# EAGLE design adp5350-breakout (EAGLE 9.6.2)
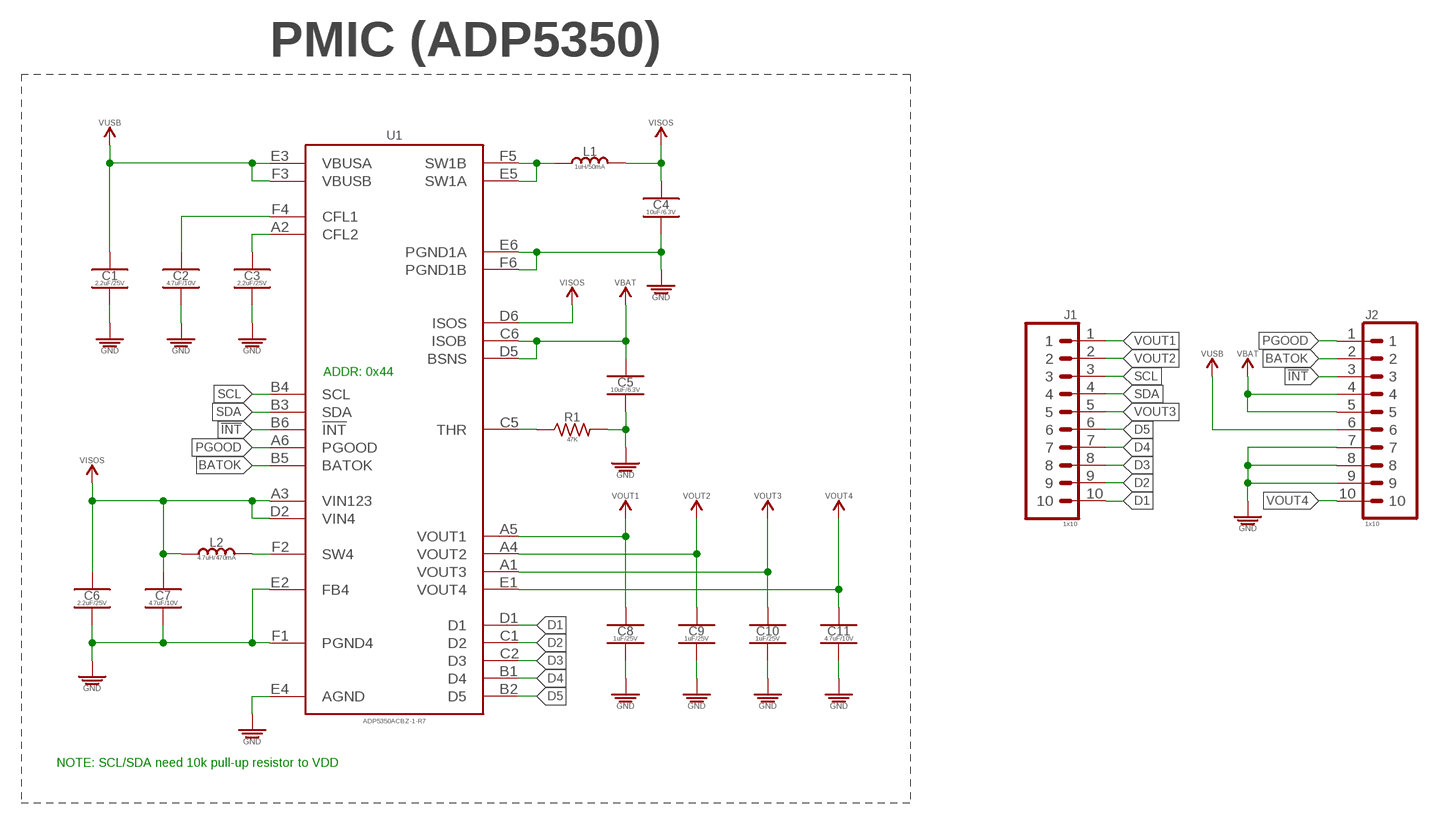
[diagram p0: schematic, sheet 1]

## Parts
C1  2.2uF/25V  2.2UF_CER_SMD-0402_25V-10%  [CAPC1005X55_SMD-0402]
C2  4.7uF/10V  4.7UF_CER_SMD-0402_10V-20%  [CAPC1005X55_SMD-0402]
C3  2.2uF/25V  2.2UF_CER_SMD-0402_25V-10%  [CAPC1005X55_SMD-0402]
C4  10uF/6.3V  10UF_CER_SMD-0402_6.3V-20%  [CAPC1005X55_SMD-0402]
C5  10uF/6.3V  10UF_CER_SMD-0402_6.3V-20%  [CAPC1005X55_SMD-0402]
C6  2.2uF/25V  2.2UF_CER_SMD-0402_25V-10%  [CAPC1005X55_SMD-0402]
C7  4.7uF/10V  4.7UF_CER_SMD-0402_10V-20%  [CAPC1005X55_SMD-0402]
C8  1uF/25V  1UF_CER_SMD-0402_25V-10%  [CAPC1005X55_SMD-0402]
C9  1uF/25V  1UF_CER_SMD-0402_25V-10%  [CAPC1005X55_SMD-0402]
C10  1uF/25V  1UF_CER_SMD-0402_25V-10%  [CAPC1005X55_SMD-0402]
C11  4.7uF/10V  4.7UF_CER_SMD-0402_10V-20%  [CAPC1005X55_SMD-0402]
J1  1x10  1X10_PTH_VERT-MALE_2.54MM  [HDRV10W64P254_1X10_2540X254X838B]
J2  1x10  1X10_PTH_VERT-MALE_2.54MM  [HDRV10W64P254_1X10_2540X254X838B]
L1  1uH/50mA  1UH_SMD-0603_0.50A-0.700OHM-10%  [INDC1608X60-0603]
L2  4.7uH/470mA  4.7UH_SMD-0603_470MA-0.312OHM-20%  [INDC1608X60-0603]
R1  47K  47KΩ_SMD-0402_1/16W-5%  [RESC1005X35_SMD-0402]
U1  ADP5350ACBZ-1-R7  [BGA36C50P6X6_331X336X66N]

## Nets
!INT!: J2.3 U1.B6(!INT!)
BATOK: J2.2 U1.B5(BATOK)
D1: J1.10 U1.D1
D2: J1.9 U1.C1(D2)
D3: J1.8 U1.C2(D3)
D4: J1.7 U1.B1(D4)
D5: J1.6 U1.B2(D5)
GND: C1.2 C2.2 C3.2 C4.2 C5.2 C6.2 C7.2 C8.2 C9.2 C10.2 C11.2 J2.7 J2.8 J2.9 R1.2 U1.E2(FB4) U1.E4(AGND) U1.E6(PGND1A) U1.F1(PGND4) U1.F6(PGND1B)
N$1: C3.1 U1.A2(CFL2)
N$2: C2.1 U1.F4(CFL1)
N$3: L2.2 U1.F2(SW4)
N$4: L1.1 U1.E5(SW1A) U1.F5(SW1B)
N$5: R1.1 U1.C5(THR)
PGOOD: J2.1 U1.A6(PGOOD)
SCL: J1.3 U1.B4(SCL)
SDA: J1.4 U1.B3(SDA)
VBAT: C5.1 J2.4 J2.5 U1.C6(ISOB) U1.D5(BSNS)
VISOS: C4.1 C6.1 C7.1 L1.2 L2.1 U1.A3(VIN123) U1.D2(VIN4) U1.D6(ISOS)
VOUT1: C8.1 J1.1 U1.A5(VOUT1)
VOUT2: C9.1 J1.2 U1.A4(VOUT2)
VOUT3: C10.1 J1.5 U1.A1(VOUT3)
VOUT4: C11.1 J2.10 U1.E1(VOUT4)
VUSB: C1.1 J2.6 U1.E3(VBUSA) U1.F3(VBUSB)

## Notes on the sheet
- PMIC (ADP5350)
- ADDR: 0x44
- NOTE: SCL/SDA need 10k pull-up resistor to VDD

## Library data of the parts
C1 C3 C6 = _capacitors:2.2UF; DATASHEET: https://product.tdk.com/info/en/catalog/datasheets/mlcc_commercial_general_en.pdf; DIST: Digikey; DISTLINK: https://www.digikey.com/products/en?keywords=445-9090-1-ND; DISTPN: 445-9090-1-ND; MFR: TDK Corporation; MPN: C1005X5R1E225K050BC
C2 C7 C11 = _capacitors:4.7UF; DATASHEET: http://www.samsungsem.com/kr/support/product-search/mlcc/CL05A475MP5NRNC.jsp; DIST: Digikey; DISTLINK: https://www.digikey.com/products/en?keywords=1276-1482-1-ND; DISTPN: 1276-1482-1-ND; MFR: Samsung Electro-Mechanics; MPN: CL05A475MP5NRNC
C4 C5 = _capacitors:10UF; DATASHEET: https://www.murata.com/~/media/webrenewal/support/library/catalog/products/capacitor/mlcc/c02e.ashx; DIST: Digikey; DISTLINK: https://www.digikey.com/products/en?keywords=490-13233-1-ND; DISTPN: 490-13233-1-ND; MFR: Murata Electronics North America; MPN: GRM155C80J106ME11D
C8-C10 = _capacitors:1UF; DATASHEET: https://product.tdk.com/info/en/catalog/datasheets/mlcc_commercial_lowprofile_en.pdf; DIST: Digikey; DISTLINK: https://www.digikey.com/products/en?keywords=445-13185-1-ND; DISTPN: 445-13185-1-ND; MFR: TDK Corporation; MPN: CGB2A1X5R1E105K033BC
J1 J2 = _connectors:1X10; DATASHEET: https://s3.amazonaws.com/catalogspreads-pdf/PAGE112-113%20.100%20MALE%20HDR.pdf; DIST: Digikey; DISTLINK: https://www.digikey.com/en/products/detail/sullins-connector-solutions/PEC10SAAN/859163?s=N4IgTCBcDaIMoEYAMCwFEC0yMDkAiIAugL5A; DISTPN: S1012E-10-ND; MFR: Sullins Connector Solutions; MPN: PEC10SAAN
L1 = _inductors:1UH; DATASHEET: https://product.tdk.com/info/en/catalog/datasheets/inductor_commercial_standard_mlf1608_en.pdf?ref_disty=digikey; DIST: Digikey; DISTLINK: https://www.digikey.com/en/products/detail/tdk-corporation/MLF1608A1R5KTA00/504184?s=N4IgTCBcDaICxwKwFoCMAGVLXIHIBEQBdAXyA; DISTPN: 445-1015-1-ND; MFR: TDK Corporation; MPN: MLF1608A1R5KTA00
L2 = _inductors:4.7UH; DATASHEET: http://ds.yuden.co.jp/TYCOMPAS/ut/detail.do?productNo=CBMF1608T4R7M&fileName=CBMF1608T4R7M_SS&mode=specSheetDownload; DIST: Digikey; DISTLINK: https://www.digikey.com/products/en?keywords=587-1719-1-ND; DISTPN: 587-1719-1-ND; MFR: Taiyo Yuden; MPN: CBMF1608T4R7M
R1 = _resistors:47KΩ; DATASHEET: http://www.yageo.com/NewPortal/yageodocoutput?fileName=/pdf/R-Chip/PYu-AC_51_RoHS_L_6.pdf; DIST: Digikey; DISTLINK: YAG3547CT-ND; DISTPN: YAG3547CT-ND; MFR: Yageo; MPN: AC0402JR-0747KL
U1 = _ic_power:ADP5350; DATASHEET: https://www.analog.com/media/en/technical-documentation/data-sheets/ADP5350.pdf; DIST: Digikey; DISTLINK: https://www.digikey.com/en/products/detail/analog-devices-inc/ADP5350ACBZ-1-R7/7932005?s=N4IgTCBcDaIIIBEAKBWAzCgDHAwgIQC0BaARiICUB2HAFSIDkEQBdAXyA; DISTPN: ADP5350ACBZ-1-R7CT-ND; MFR: Analog Devices Inc.; MPN: ADP5350ACBZ-1-R7

## Board
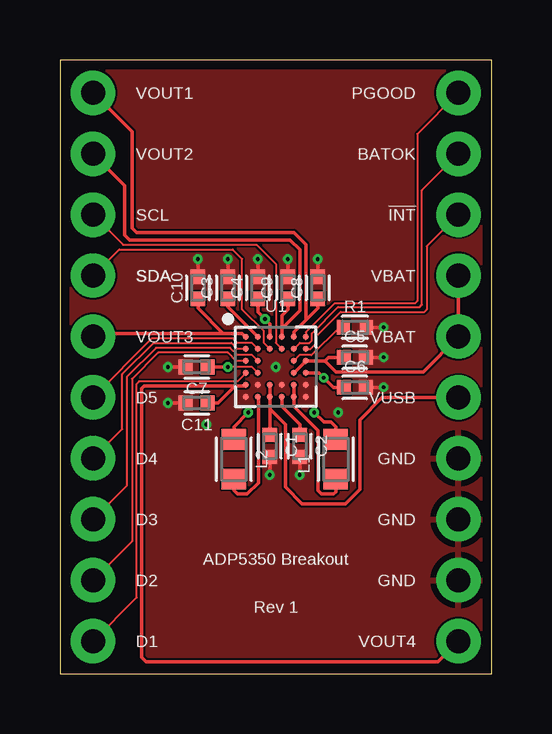
[diagram p1: board, top side]
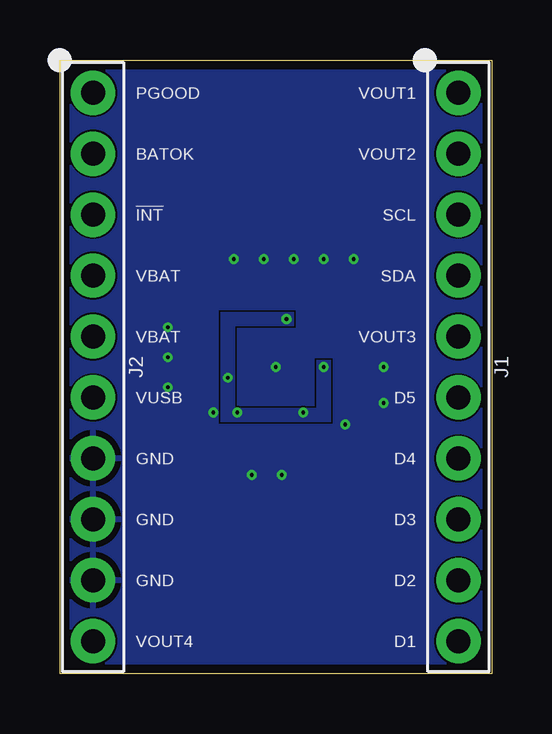
[diagram p2: board, bottom side, seen from below]

Size 18 x 25.6 mm. Coordinates in mm from the lower left corner, seen from the top.
Outline: 0,0 18,0 18,25.6 0,25.6 0,0
Copper layers (1*16): Top 0.035559375mm / dielectric 1.6mm / Bottom 0.035559375mm
Design rules "stella-wearables": minimum track width 3mil, minimum drill 6mil, track to track 3mil, track to pad 3mil, pad to pad 3mil, via to via 3mil, smd to smd 3mil, copper to edge 15mil, drill to drill 6mil, minimum pad ring 5mil, minimum via ring 5mil, stop-mask expansion 2.5mil, vias tented up to drill 0mil, thermal gap 10mil

### Footprints (pad centres in the part's own frame; a part is rotated, then mirrored left to right if it is on the bottom)
CAPC1005X55_SMD-0402 = smd 0.585 x 0.612: 1 -0.458,0; 2 0.458,0
HDRV10W64P254_1X10_2540X254X838B = drill 1 pad 1.85: 1 -11.43,0; 2 -8.89,0; 3 -6.35,0; 4 -3.81,0; 5 -1.27,0; 6 1.27,0; 7 3.81,0; 8 6.35,0; 9 8.89,0; 10 11.43,0
INDC1608X60-0603 = smd 0.859 x 1.015: 1 -0.828,0; 2 0.828,0
RESC1005X35_SMD-0402 = smd 0.535 x 0.6: 1 -0.482,0; 2 0.482,0
BGA36C50P6X6_331X336X66N = smd 0.25 x 0.25: A1 -1.25,1.25; A2 -0.75,1.25; A3 -0.25,1.25; A4 0.25,1.25; A5 0.75,1.25; A6 1.25,1.25; B1 -1.25,0.75; B2 -0.75,0.75; B3 -0.25,0.75; B4 0.25,0.75; B5 0.75,0.75; B6 1.25,0.75; C1 -1.25,0.25; C2 -0.75,0.25; C5 0.75,0.25; C6 1.25,0.25; D1 -1.25,-0.25; D2 -0.75,-0.25; D5 0.75,-0.25; D6 1.25,-0.25; E1 -1.25,-0.75; E2 -0.75,-0.75; E3 -0.25,-0.75; E4 0.25,-0.75; E5 0.75,-0.75; E6 1.25,-0.75; F1 -1.25,-1.25; F2 -0.75,-1.25; F3 -0.25,-1.25; F4 0.25,-1.25; F5 0.75,-1.25; F6 1.25,-1.25

### Placement (x,y rotation side)
C1  8.75,9.5 270 top
C2  10,9.5 270 top
C3  7,16.1 90 top
C4  8.25,16.1 90 top
C5  12.3,13.2 0 top
C6  12.3,11.95 0 top
C7  5.7,12.8 180 top
C8  10.75,16.1 90 top
C9  9.5,16.1 90 top
C10  5.75,16.1 90 top
C11  5.7,11.3 180 top
J1  1.38,12.8 270 bottom
J2  16.62,12.8 270 bottom
L1  11.5,8.95 90 top
L2  7.25,8.95 270 top
R1  12.3,14.45 0 top
U1  9,12.8 0 top

### Tracks (layer width: path | path; a pad name or v marks a point on that pad's centre or on a via)
!INT!
  Top 0.076: U1.B6 10.45,13.55 10.7,13.8 10.7,14.1 11.7,15.1 15.2,15.1 15.3,15.2 15.3,17.83 J2.3
BATOK
  Top 0.076: U1.B5 10,13.8 10.4,13.8 10.5,13.9 10.5,14.2 11.6,15.3 15,15.3 15.1,15.4 15.1,20.17 J2.2
D1
  Top 0.076: U1.D1 7.4,12.2 3.3,12.2 3.2,12.1 3.2,3.19 J1.10
D2
  Top 0.076: U1.C1 7.35,13.05 7,13.4 4.1,13.4 3,12.3 3,5.53 J1.9
D3
  Top 0.076: U1.C2 8,13.3 7.4,13.3 7.1,13.6 4,13.6 2.8,12.4 2.8,7.87 J1.8
D4
  Top 0.076: U1.B1 7.4,13.55 7.15,13.8 3.9,13.8 2.6,12.5 2.6,10.21 J1.7
D5
  Top 0.076: U1.B2 8,13.8 7.4,13.8 7.2,14 3.85,14 J1.6
GND  (via drill 0.15, 0.15 pad 0.15)
  Top 0.152: C1.2 v8.75,8.3 | C2.2 v10,8.3 | C6.2 v13.5,11.95 | C5.2 v13.5,13.2 | R1.2 v13.5,14.45 | C8.2 v10.75,17.3 | C9.2 v9.5,17.3 | C4.2 v8.25,17.3 | C3.2 v7,17.3 | C10.2 v5.75,17.3 | C7.2 v4.5,12.8 | C11.2 v4.5,11.3
  other vias: 9,12.8 11.6,10.9 6.1,10.4
  pour Bottom (rank 6): 0,0 18,0 18,25.6 0,25.6
  pour Top (rank 6): 0,0 18,0 18,25.6 0,25.6
N$1
  Top 0.152: C3.1 7,15.3 U1.A2
N$2
  Top 0.152: C2.1 10,10.4 9.25,11.15 U1.F4
N$3
  Top 0.152: U1.F2 8.27,11.53 8.27,7.97 7.8,7.5 7.4,7.5 7.25,7.65 L2.2
N$4
  Top 0.152: U1.E5 U1.F5 9.75,11.15 10.75,10.15 10.75,7.65 10.9,7.5 11.4,7.5 11.5,7.6 L1.1
N$5
  Top 0.076: U1.C5 9.99,13.29 10.49,13.29 11.65,14.45 R1.1
PGOOD
  Top 0.076: U1.A6 10.25,14.25 11.45,15.45 14.8,15.45 14.9,15.55 14.9,22.51 J2.1
SCL
  Top 0.076: U1.B4 9,13.8 9,17.1 8.2,17.9 2.63,17.9 J1.3
SDA
  Top 0.076: U1.B3 8.5,13.8 8.5,14.3 7.6,15.2 7.6,17.3 7.2,17.7 2.47,17.7 J1.4
VBAT
  Top 0.152: 11.05,13.05 U1.C6 U1.D5 | 11.05,13.05 11.5,12.6 15.15,12.6 J2.5 J2.4 | C5.1 11.2,13.2 11.05,13.05
VISOS  (via drill 0.15 pad 0.15)
  Top 0.076: U1.D2 8,12.8 v7,12.8
  Top 0.152: C7.1 v7,12.8 | U1.A3 8.75,14.6 v8.55,14.8 8.25,15.1 C4.1 | v7.85,10.9 7.25,10.3 L2.1 | L1.2 11.5,10.3 11.3,10.5 11,10.5 v10.6,10.9 | U1.D6 10.8,12.55 v11,12.35 11.4,11.95 C6.1
  pour Bottom: 7.3,13.1 7.3,11.1 10.7,11.1 10.7,14.5 8.25,14.5 8.25,15.1 11.3,15.1 11.3,10.5 6.7,10.5 6.7,13.1
VOUT1
  Top 0.152: U1.A5 9.75,14.25 10.25,14.75 | C8.1 10.75,15.25 10.25,14.75 | 10.25,14.75 10.25,17.9 9.75,18.4 3.2,18.4 3,18.6 3,22.61 J1.1
VOUT2
  Top 0.152: U1.A4 9.25,14.4 | 9.25,14.4 9.25,14.95 9.5,15.2 C9.1 | 9.25,14.4 10,15.15 10,17.7 9.6,18.1 2.9,18.1 2.7,18.3 2.7,20.37 J1.2
VOUT3
  Top 0.152: U1.A1 7.6,14.2 6.8,14.2 | C10.1 5.75,15.25 6.8,14.2 | J1.5 1.51,14.2 6.8,14.2
VOUT4
  Top 0.152: U1.E1 7.7,12 7.3,12 | C11.1 6.6,11.3 7.3,12 | 7.3,12 3.5,12 3.4,11.9 3.4,0.7 3.6,0.5 15.75,0.5 J2.10
VUSB
  Top 0.152: U1.E3 U1.F3 8.75,11.05 | C1.1 8.75,11.05 | 8.75,11.05 9.4,10.4 9.4,7.8 10.1,7.1 11.9,7.1 12.5,7.7 12.5,10.6 13.43,11.53 J2.6

### Text on the board
tPlace: VOUT1 | PGOOD | VOUT2 | BATOK | SCL | !INT! | SDA | SDA | VBAT | VOUT3 | VBAT | D5 | VUSB | D4 | GND | D3 | GND | ADP5350 Breakout | D2 | GND | Rev 1 | D1 | VOUT4
bPlace: VOUT1 | PGOOD | VOUT2 | BATOK | SCL | !INT! | SDA | VBAT | VOUT3 | VBAT | D5 | VUSB | D4 | GND | D3 | GND | D2 | GND | D1 | VOUT4